# Altium schematic sheet pca20017_power.SchDoc: nRF52 Quadcopter - Power
size A4; Organization: Nordic Semiconductor; DocumentNumber: 4; Revision: 1.0.0; SheetNumber: 4; SheetTotal: 5; CompanyName: Nordic Semiconductor; DrawnBy: ERHE; ProjectNumber: 4425; DocumentSize: A4; PCAName: PCA20017; PCBRevision: 0002ERHE; PCBNumber: 400151
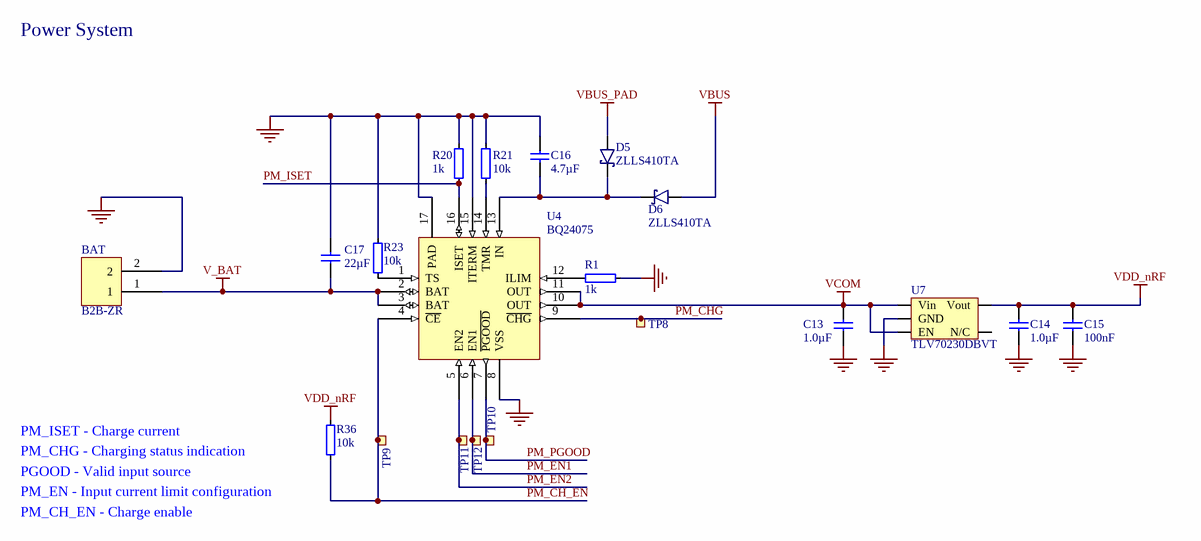
[diagram p0: pca20017_power.SchDoc]

## Parts
BAT  B2B-ZR  [B2B-ZR]
C13  1.0µF  [CAPC1005X04L]
C14  1.0µF  [CAPC1005X04L]
C15  100nF  [CAPC1005X04L]
C16  4.7µF  [CAPC1005X04L]
C17  22µF  [CAPC2012X11L]
D5  ZLLS410TA  [SOD-323]
D6  ZLLS410TA  [SOD-323]
R1  1k  [RESC1005X04L]
R20  1k  [RESC1005X04L]
R21  10k  [RESC1005X04L]
R23  10k  [RESC1005X04L]
R36  10k  [RESC1005X04L]
TP8  Ø1.0mm,SMD  [TP_SMD_Ø1.0mm]  (value not drawn)  (no BOM)
TP9  Ø1.0mm,SMD  [TP_SMD_Ø1.0mm]  (value not drawn)  (no BOM)
TP10  Ø1.0mm,SMD  [TP_SMD_Ø1.0mm]  (value not drawn)  (no BOM)
TP11  Ø1.0mm,SMD  [TP_SMD_Ø1.0mm]  (value not drawn)  (no BOM)
TP12  Ø1.0mm,SMD  [TP_SMD_Ø1.0mm]  (value not drawn)  (no BOM)
U4  BQ24075  [QFN50P300X300X100_HS-17N]
U7  TLV70230DBVT  [SOT-23-5]

## Nets
GND: BAT.2 C13.1 C14.1 C15.1 C16.2 C17.2 R1.2 R20.2 R21.2 R23.1 U4.8(VSS) U4.15(ITERM) U4.17(PAD) U7.2(GND)
V_BAT: BAT.1 C17.1 U4.2(BAT) U4.3(BAT)
VBUS: D6.1(A)
VBUS_PAD: D5.1(A)
VCOM: C13.2 U4.10(OUT) U4.11(OUT) U7.1(Vin) U7.3(EN)
VDD_nRF: C14.2 C15.2 R36.2 U7.5(Vout)
PM_CH_EN: R36.1 TP9.1 U4.4(~{CE})
PM_CHG: TP8.1 U4.9(~{CHG})
PM_EN1: TP12.1 U4.6(EN1)
PM_EN2: TP11.1 U4.5(EN2)
PM_ISET: R20.1 U4.16(ISET)
PM_PGOOD: TP10.1 U4.7(~{PGOOD})
NetC16_1: C16.1 D5.3(C) D6.3(C) U4.13(IN)
NetR1_1: R1.1 U4.12(ILIM)
NetR21_1: R21.1 U4.14(TMR)
NetR23_2: R23.2 U4.1(TS)

Not connected (* = marked no-connect by the designer): U7 4(N/C)

## Notes on the sheet
- Power System
- PM_ISET - Charge current
- PM_CHG - Charging status indication
- (near R36) PM_EN - Input current limit configuration
- PM_CH_EN - Charge enable
- PGOOD - Valid input source
- Title
- Size
- Date:
- Project Number
- Sheet         of
- Revision
- File:
- Drawn By:

## Library data of the parts
BAT = B2B-ZR: CONN JST 2POS 0.059" (1.50mm); Manufacturer: JST Sales America Inc; Manufacturer Part Number: B2B-ZR(LF)(SN); Artikkelnr Noca: N.A.; Part Number: B2B-ZR; Datasheet: http://www.jst-mfg.com/product/pdf/eng/eZH.pdf; Footprint Doc: B2B-ZR; LatestRevisionDate: 2015-07-02; Pin Count: 2; Publisher: Nordic Semiconductor; Published: 2015-07-02; Value: B2B-ZR; Note: *; Supplier: Digi-Key; Supplier part number: 455-1657-ND; 2nd source Supplier: *; 2nd source part number: *; Artikkelnr Simpro: N.A.
C13 C14 = C0402-1µ0: Capacitor, X5R, ±5%; Note: 6.3V; Artikkelnr Noca: 20039235; Artikkelnr Simpro: N.A.; Part Number: C0402-1µ0; Manufacturer: *; Manufacturer Part Number: *; Datasheet: *; Footprint Doc: 0402; LatestRevisionDate: 2009-11-23; Pin Count: 2; Publisher: Nordic Semiconductor; Published: 2009-05-08; Value: 1.0µF; Supplier: *; Supplier part number: *; 2nd source Supplier: *; 2nd source part number: *
C15 = C0402-100n: Capacitor, X7R, ±10%; Note: 16V; Artikkelnr Noca: 20039200; Artikkelnr Simpro: N.A.; Part Number: C0402-100n; Manufacturer: *; Manufacturer Part Number: *; Datasheet: *; Footprint Doc: 0402; LatestRevisionDate: 2009-11-23; Pin Count: 2; Publisher: Nordic Semiconductor; Published: 2009-05-08; Value: 100nF; Supplier: *; Supplier part number: *; 2nd source Supplier: *; 2nd source part number: *
C16 = C0402-4µ7: Capacitor, X5R, ±20%; Note: 10V; Artikkelnr Noca: 20039482; Artikkelnr Simpro: N.A.; Part Number: C0402-4µ7; Manufacturer: *; Manufacturer Part Number: *; Datasheet: *; Footprint Doc: 0402; LatestRevisionDate: 2016-06-02; Pin Count: 2; Publisher: Nordic Semiconductor; Published: 2009-05-08; Value: 4.7µF; Supplier: *; Supplier part number: *; 2nd source Supplier: *; 2nd source part number: *
C17 = C0805-22µ: Capacitor, X5R, ±10%; Note: 6.3V; Artikkelnr Noca: 20039330; Artikkelnr Simpro: N.A.; Part Number: C0805-22µ; Manufacturer: *; Manufacturer Part Number: *; Datasheet: *; Footprint Doc: 0805; LatestRevisionDate: 2013-06-04; Pin Count: 2; Publisher: Nordic Semiconductor; Published: 2011-01-17; Value: 22µF; Supplier: *; Supplier part number: *; 2nd source Supplier: *; 2nd source part number: *
D5 D6 = ZLLS410TA: DIODE SCHOTTKY 10V 0.57A SOD323; Manufacturer: Diodes Incorporated; 2nd source part number: 522-ZLLS410TA; Artikkelnr Noca: N.A.; Part Number: ZLLS410TA; Manufacturer Part Number: ZLLS410TA; Datasheet: http://www.diodes.com/datasheets/ZLLS410.pdf; Footprint Doc: SOD-323; LatestRevisionDate: 2014-12-11; Publisher: Nordic Semiconductor; Published: 2014-12-11; Value: ZLLS410TA; Note: *; Supplier: Digi-Key; Supplier part number: ZLLS410CT-ND; 2nd source Supplier: Mouser; Artikkelnr Simpro: N.A.
R1 R20 = R0402-1k0: Resistor, ±1%, 0.063W; Note: Chip Res 1%; Artikkelnr Noca: 27049073; Artikkelnr Simpro: N.A.; Value Ohm: 1000; Part Number: R0402-1k0; Manufacturer: *; Manufacturer Part Number: *; Datasheet: *; Footprint Doc: 0402; LatestRevisionDate: 2009-11-23; Pin Count: 2; Publisher: Nordic Semiconductor; Published: 2009-05-08; Value: 1k; Supplier: Farnell; Supplier part number: 173-8850; 2nd source Supplier: *; 2nd source part number: *
R21 R23 R36 = R0402-10k: Resistor, ±1%, 0.063W; Note: Chip Res 1%; Artikkelnr Noca: 27049097; Artikkelnr Simpro: N.A.; Value Ohm: 10000; Part Number: R0402-10k; Manufacturer: *; Manufacturer Part Number: *; Datasheet: *; Footprint Doc: 0402; LatestRevisionDate: 2009-11-23; Pin Count: 2; Publisher: Nordic Semiconductor; Published: 2009-05-08; Value: 10k; Supplier: Farnell; Supplier part number: 173-8864; 2nd source Supplier: *; 2nd source part number: *
TP8-TP12 = TP_SMD_Ø1.0MM: 1.0mm circular SMD testpad; Manufacturer: Nordic Semiconductor; Artikkelnr Noca: N.A.; Part Number: TP_SMD_Ø1.0MM; Manufacturer Part Number: *; Datasheet: *; Footprint Doc: TP_SMD_Ø1.0mm; LatestRevisionDate: 2013-06-11; Pin Count: 1; Publisher: Nordic Semiconductor; Published: 2013-06-11; Value: Ø1.0mm,SMD; Note: *; Supplier: *; Supplier part number: *; 2nd source Supplier: *; 2nd source part number: *; Artikkelnr Simpro: N.A.
U4 = BQ24075: IC SINGLE CELL USB LI-ION CHARGER; Manufacturer: Texas Instruments; Manufacturer Part Number: BQ24075RGTT; Note: USB-Friendly Li-Ion Battery Charger and Power-Path Management IC, Vout 5.5V; Artikkelnr Noca: N.A.; Part Number: BQ24075; Datasheet: http://www.ti.com/lit/ds/symlink/bq24075.pdf; Footprint Doc: S-PVQFN-N16; LatestRevisionDate: 2015-06-24; Pin Count: 16; Publisher: Nordic Semiconductor; Published: 2015-06-24; Value: BQ24075; Supplier: Digi-Key; Supplier part number: 296-23840-1-ND; 2nd source Supplier: *; 2nd source part number: *; Artikkelnr Simpro: N.A.
U7 = TLV70230DBVT: IC REG LDO 3V 300MA SOT23-5; Manufacturer: Texas Instruments; Note: 300-mA, Low-IQ, Low-Dropout Regulator; Artikkelnr Noca: N.A.; Part Number: TLV70230DBVT; Manufacturer Part Number: TLV70230DBVT; Datasheet: http://www.ti.com/lit/ds/symlink/tlv70218.pdf; Footprint Doc: SOT-23-5; LatestRevisionDate: 2015-06-24; Pin Count: 5; Publisher: Nordic Semiconductor; Published: 2015-06-24; Value: TLV70230DBVT; Supplier: Digi-Key; Supplier part number: 296-27893-1-ND; 2nd source Supplier: *; 2nd source part number: *; Artikkelnr Simpro: N.A.